# Altium project 4x tmc5160.PrjPcb (part 2 of 2)

## Sheet 4x tmc5160.SchDoc
size 297 x 209 mm
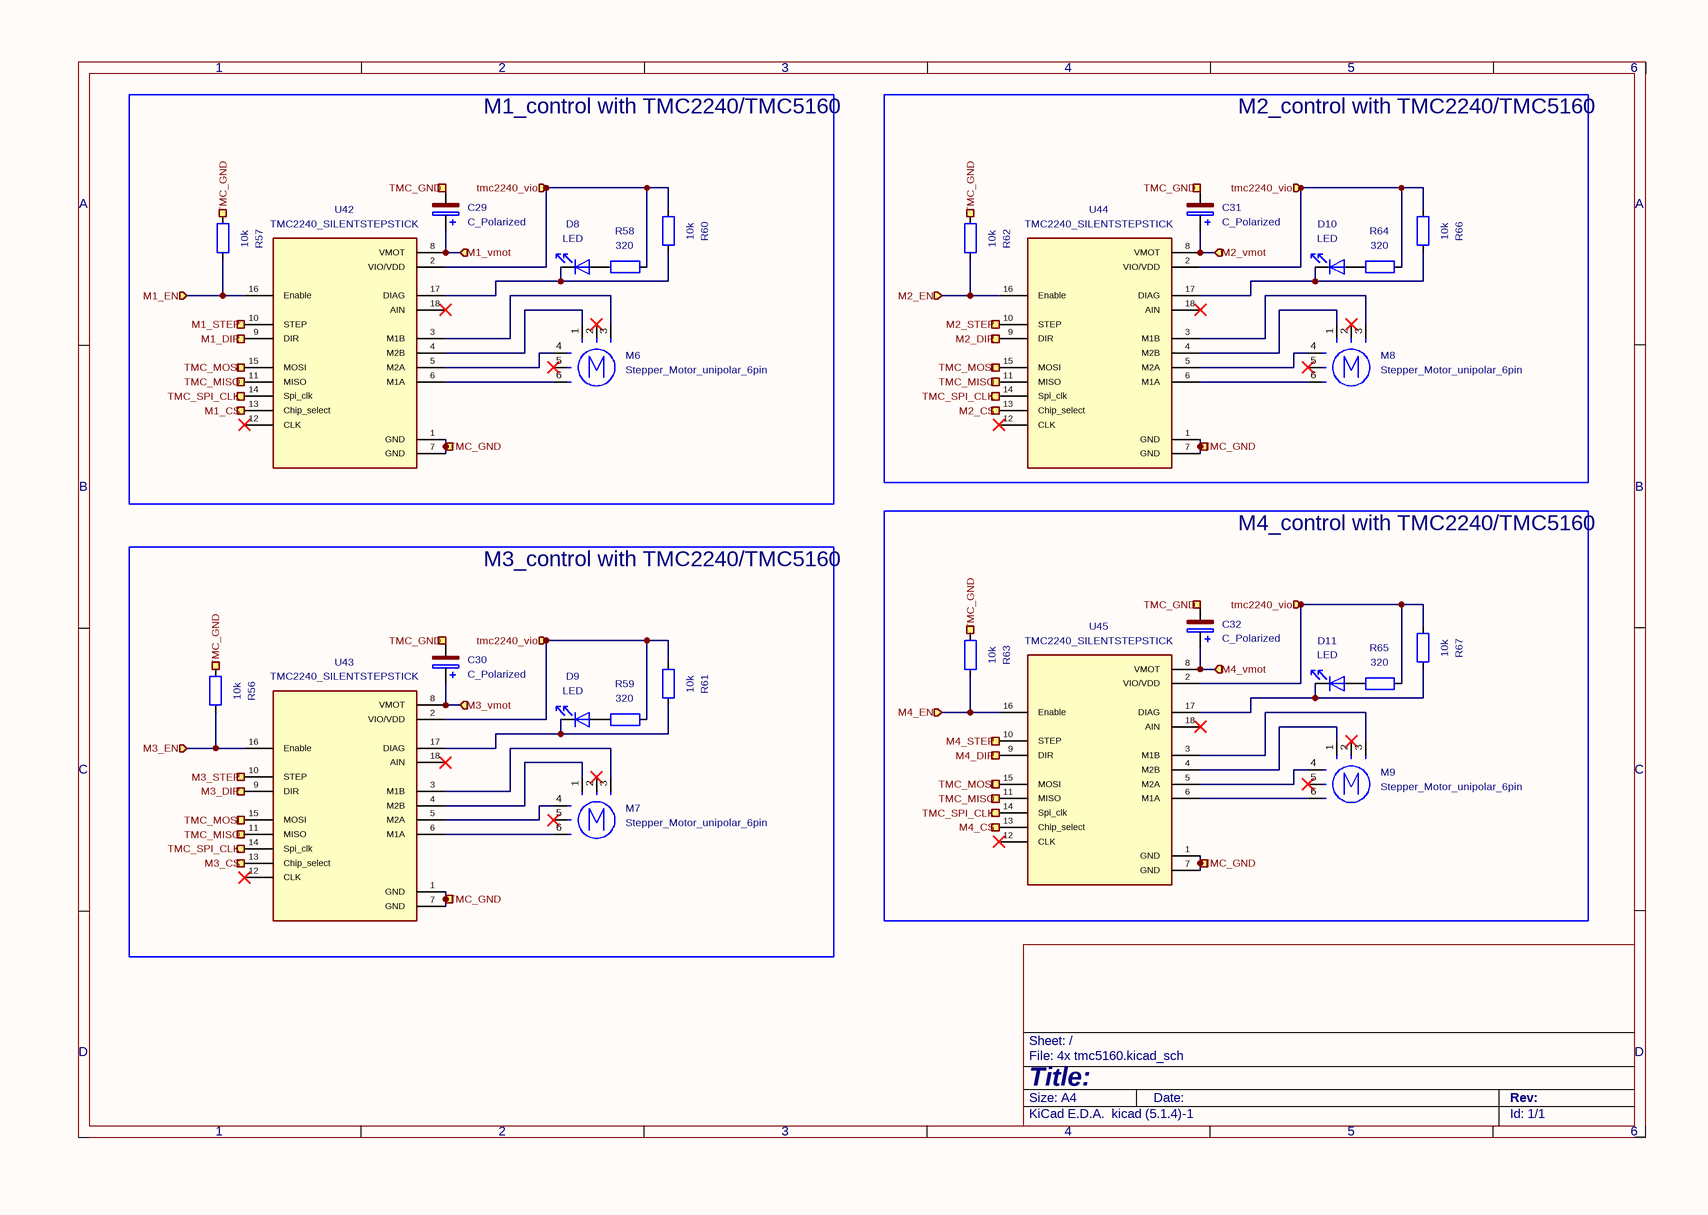
[diagram p7: 4x tmc5160.SchDoc]

### Parts
C29  C_Polarized
C30  C_Polarized
C31  C_Polarized
C32  C_Polarized
D8  LED
D9  LED
D10  LED
D11  LED
M6  Stepper_Motor_unipolar_6pin
M7  Stepper_Motor_unipolar_6pin
M8  Stepper_Motor_unipolar_6pin
M9  Stepper_Motor_unipolar_6pin
R56  10k
R57  10k
R58  320
R59  320
R60  10k
R61  10k
R62  10k
R63  10k
R64  320
R65  320
R66  10k
R67  10k
U42  TMC2240_SILENTSTEPSTICK  [MODULE_TMC2209_SILENTSTEPSTICK]
U43  TMC2240_SILENTSTEPSTICK  [MODULE_TMC2209_SILENTSTEPSTICK]
U44  TMC2240_SILENTSTEPSTICK  [MODULE_TMC2209_SILENTSTEPSTICK]
U45  TMC2240_SILENTSTEPSTICK  [MODULE_TMC2209_SILENTSTEPSTICK]

### Blocks framed on the sheet
M1_control with TMC2240/TMC5160: C29 D8 M6 R57 R58 R60 U42
M2_control with TMC2240/TMC5160: C31 D10 M8 R62 R64 R66 U44
M4_control with TMC2240/TMC5160: C32 D11 M9 R63 R65 R67 U45
M3_control with TMC2240/TMC5160: C30 D9 M7 R56 R59 R61 U43

### Ports
M1_CS (in), M1_DIR (in), M1_EN (in), M1_STEP (in), M1_vmot (in), M2_CS (in), M2_DIR (in), M2_EN (in), M2_STEP (in), M2_vmot (in), M3_CS (in), M3_DIR (in), M3_EN (in), M3_STEP (in), M3_vmot (in), M4_CS (in), M4_DIR (in), M4_EN (in), M4_STEP (in), M4_vmot (in), tmc2240_vio (in), TMC_GND (in), TMC_MISO (in), TMC_MOSI (in), TMC_SPI_CLK (in)

### Nets
M1_CS: U42.13(Chip_select) ; port M1_CS
M1_DIR: U42.9(DIR) ; port M1_DIR
M1_EN: R57.1 U42.16(Enable) ; port M1_EN
M1_STEP: U42.10(STEP) ; port M1_STEP
M1_vmot: C29.1 U42.8(VMOT) ; port M1_vmot
M2_CS: U44.13(Chip_select) ; port M2_CS
M2_DIR: U44.9(DIR) ; port M2_DIR
M2_EN: R62.1 U44.16(Enable) ; port M2_EN
M2_STEP: U44.10(STEP) ; port M2_STEP
M2_vmot: C31.1 U44.8(VMOT) ; port M2_vmot
M3_CS: U43.13(Chip_select) ; port M3_CS
M3_DIR: U43.9(DIR) ; port M3_DIR
M3_EN: R56.1 U43.16(Enable) ; port M3_EN
M3_STEP: U43.10(STEP) ; port M3_STEP
M3_vmot: C30.1 U43.8(VMOT) ; port M3_vmot
M4_CS: U45.13(Chip_select) ; port M4_CS
M4_DIR: U45.9(DIR) ; port M4_DIR
M4_EN: R63.1 U45.16(Enable) ; port M4_EN
M4_STEP: U45.10(STEP) ; port M4_STEP
M4_vmot: C32.1 U45.8(VMOT) ; port M4_vmot
tmc2240_vio: R58.2 R59.2 R60.2 R61.2 R64.2 R65.2 R66.2 R67.2 U42.2(VIO/VDD) U43.2(VIO/VDD) U44.2(VIO/VDD) U45.2(VIO/VDD) ; port tmc2240_vio
TMC_GND: C29.2 C30.2 C31.2 C32.2 R56.2 R57.2 R62.2 R63.2 U42.1(GND) U42.7(GND) U43.1(GND) U43.7(GND) U44.1(GND) U44.7(GND) U45.1(GND) U45.7(GND) ; port TMC_GND
TMC_MISO: U42.11(MISO) U43.11(MISO) U44.11(MISO) U45.11(MISO) ; port TMC_MISO
TMC_MOSI: U42.15(MOSI) U43.15(MOSI) U44.15(MOSI) U45.15(MOSI) ; port TMC_MOSI
TMC_SPI_CLK: U42.14(Spi_clk) U43.14(Spi_clk) U44.14(Spi_clk) U45.14(Spi_clk) ; port TMC_SPI_CLK
NetD8_1: D8.1(K) R60.1 U42.17(DIAG)
NetD8_2: D8.2(A) R58.1
NetD9_1: D9.1(K) R61.1 U43.17(DIAG)
NetD9_2: D9.2(A) R59.1
NetD10_1: D10.1(K) R66.1 U44.17(DIAG)
NetD10_2: D10.2(A) R64.1
NetD11_1: D11.1(K) R67.1 U45.17(DIAG)
NetD11_2: D11.2(A) R65.1
NetM6_1: M6.1 U42.4(M2B)
NetM6_3: M6.3(-) U42.3(M1B)
NetM6_4: M6.4 U42.5(M2A)
NetM6_6: M6.6 U42.6(M1A)
NetM7_1: M7.1 U43.4(M2B)
NetM7_3: M7.3(-) U43.3(M1B)
NetM7_4: M7.4 U43.5(M2A)
NetM7_6: M7.6 U43.6(M1A)
NetM8_1: M8.1 U44.4(M2B)
NetM8_3: M8.3(-) U44.3(M1B)
NetM8_4: M8.4 U44.5(M2A)
NetM8_6: M8.6 U44.6(M1A)
NetM9_1: M9.1 U45.4(M2B)
NetM9_3: M9.3(-) U45.3(M1B)
NetM9_4: M9.4 U45.5(M2A)
NetM9_6: M9.6 U45.6(M1A)

Not connected (* = marked no-connect by the designer): M6 2* 5*; M7 2* 5*; M8 2* 5*; M9 2* 5*; U42 12(CLK)* 18(AIN)*; U43 12(CLK)* 18(AIN)*; U44 12(CLK)* 18(AIN)*; U45 12(CLK)* 18(AIN)*

### Notes on the sheet
- 1
- 2
- 3
- 4
- 5
- 6
- A
- B
- C
- D
- Title:
- File: 4x tmc5160.kicad_sch
- Sheet: /
- KiCad E.D.A.  kicad (5.1.4)-1
- Size: A4
- Date:
- Rev:
- Id: 1/1

### Library data of the parts
R56-R67 = R
  R56 R57 R60-R63 R66 R67: Value: 10k
  R58 R59 R64 R65: Value: 320
U42-U45 = TMC2209_SILENTSTEPSTICK: MF: Trinamic Motion Control GmbH; Description_1: \n                        \n                            TMC2209 Motor Controller/Driver Power Management Evaluation Board\n                        \n; MP: TMC2209 SILENTSTEPSTICK; Package: None; Price: None; Check_prices: https://www.snapeda.com/parts/TMC2209%20SILENTSTEPSTICK/Trinamic/view-part/?ref=eda; STANDARD: Manufacturer Recommendations; PARTREV: 1.20; SnapEDA_Link: https://www.snapeda.com/parts/TMC2209%20SILENTSTEPSTICK/Trinamic/view-part/?ref=snap; MANUFACTURER: Trinamic Motion Control GmbH; Availability: In Stock; SNAPEDA_PN: TMC2209 SILENTSTEPSTICK; Value: TMC2240_SILENTSTEPSTICK; Footprint: fds:MODULE_TMC2209_SILENTSTEPSTICK
C29-C32 = C_Polarized: Value: C_Polarized
D8-D11 = LED: Value: LED
M6-M9 = Stepper_Motor_unipolar_6pin: Value: Stepper_Motor_unipolar_6pin

## Sheet adc.SchDoc
size 297 x 209 mm
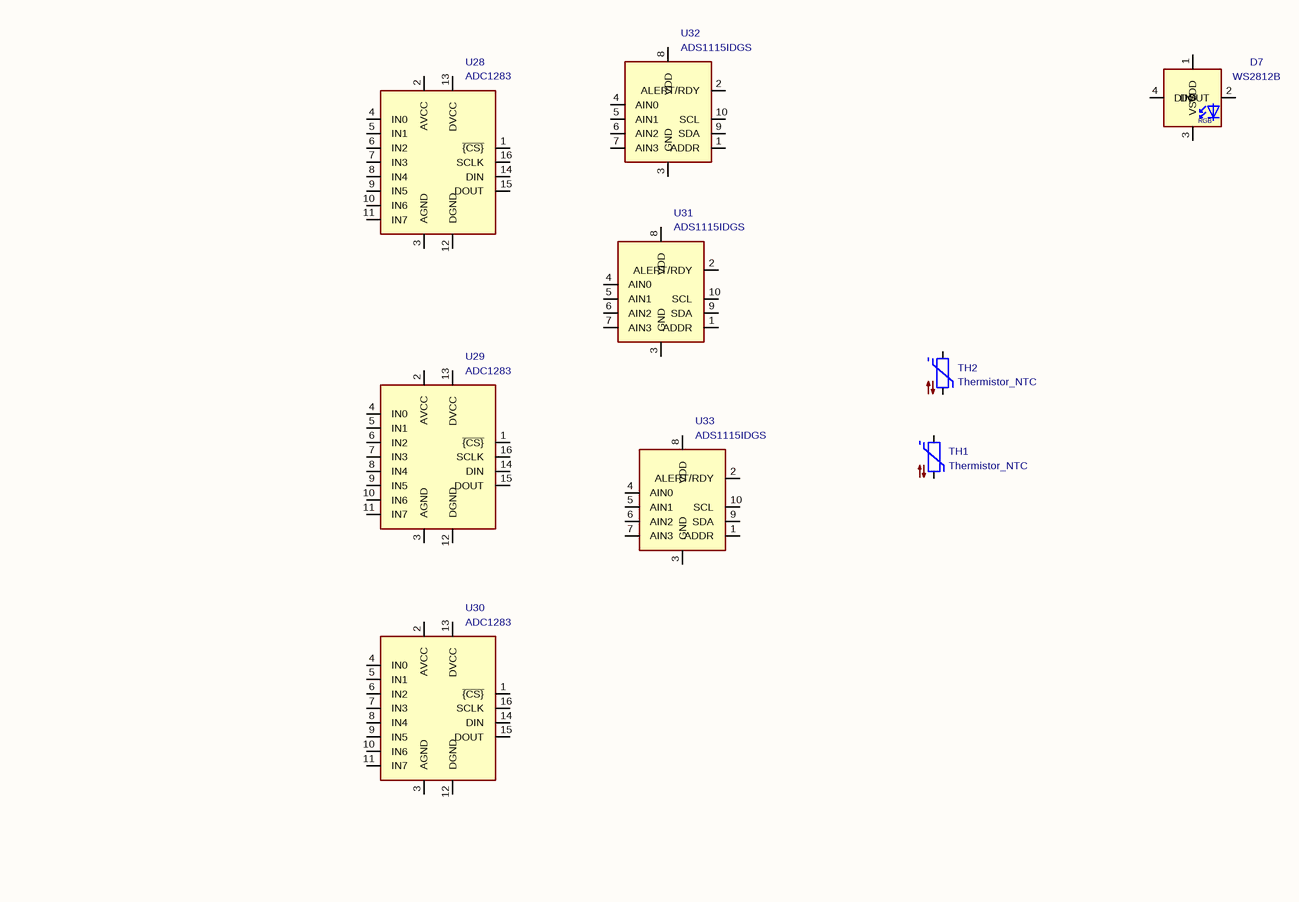
[diagram p8: adc.SchDoc]

### Parts
D7  WS2812B  [LED_WS2812B_PLCC4_5.0x5.0mm_P3.2mm]
TH1  Thermistor_NTC
TH2  Thermistor_NTC
U28  ADC1283  [TSSOP-16_4.4x5mm_P0.65mm]
U29  ADC1283  [TSSOP-16_4.4x5mm_P0.65mm]
U30  ADC1283  [TSSOP-16_4.4x5mm_P0.65mm]
U31  ADS1115IDGS  [TSSOP-10_3x3mm_P0.5mm]
U32  ADS1115IDGS  [TSSOP-10_3x3mm_P0.5mm]
U33  ADS1115IDGS  [TSSOP-10_3x3mm_P0.5mm]

### Nets

Not connected (* = marked no-connect by the designer): D7 1(VDD) 2(DOUT) 3(VSS) 4(DIN); TH1 1 2; TH2 1 2; U28 1(~{{CS}}) 2(AVCC) 3(AGND) 4(IN0) 5(IN1) 6(IN2) 7(IN3) 8(IN4) 9(IN5) 10(IN6) 11(IN7) 12(DGND) 13(DVCC) 14(DIN) 15(DOUT) 16(SCLK); U29 1(~{{CS}}) 2(AVCC) 3(AGND) 4(IN0) 5(IN1) 6(IN2) 7(IN3) 8(IN4) 9(IN5) 10(IN6) 11(IN7) 12(DGND) 13(DVCC) 14(DIN) 15(DOUT) 16(SCLK); U30 1(~{{CS}}) 2(AVCC) 3(AGND) 4(IN0) 5(IN1) 6(IN2) 7(IN3) 8(IN4) 9(IN5) 10(IN6) 11(IN7) 12(DGND) 13(DVCC) 14(DIN) 15(DOUT) 16(SCLK); U31 1(ADDR) 2(ALERT/RDY) 3(GND) 4(AIN0) 5(AIN1) 6(AIN2) 7(AIN3) 8(VDD) 9(SDA) 10(SCL); U32 1(ADDR) 2(ALERT/RDY) 3(GND) 4(AIN0) 5(AIN1) 6(AIN2) 7(AIN3) 8(VDD) 9(SDA) 10(SCL); U33 1(ADDR) 2(ALERT/RDY) 3(GND) 4(AIN0) 5(AIN1) 6(AIN2) 7(AIN3) 8(VDD) 9(SDA) 10(SCL)

### Notes on the sheet
- 1
- 2
- 3
- 4
- 5
- 6
- A
- B
- C
- D
- Title:
- File: adc.kicad_sch
- Sheet: /
- KiCad E.D.A.  kicad (5.1.4)-1
- Size: A4
- Date:
- Rev:
- Id: 1/1
- (in symbol WS2812B) RGB

### Library data of the parts
D7 = WS2812B: Description: RGB LED with integrated controller; Value: WS2812B; Footprint: LED_SMD:LED_WS2812B_PLCC4_5.0x5.0mm_P3.2mm
TH1 TH2 = Thermistor_NTC: Description: Temperature dependent resistor, negative temperature coefficient; Value: Thermistor_NTC
U28-U30 = ADC1283: Description: Low power 8-channel single ended 12-bit SAR ADC, 50 ksps to 200 ksps, SPI, TSSOP-16; Value: ADC1283; Footprint: Package_SO:TSSOP-16_4.4x5mm_P0.65mm
U31-U33 = ADS1115IDGS: Description: Ultra-Small, Low-Power, I2C-Compatible, 860-SPS, 16-Bit ADCs With Internal Reference, Oscillator, and Programmable Comparator, VSSOP-10; Value: ADS1115IDGS; Footprint: Package_SO:TSSOP-10_3x3mm_P0.5mm

## Sheet USB2-HUB.SchDoc
size 1188 x 840 mm
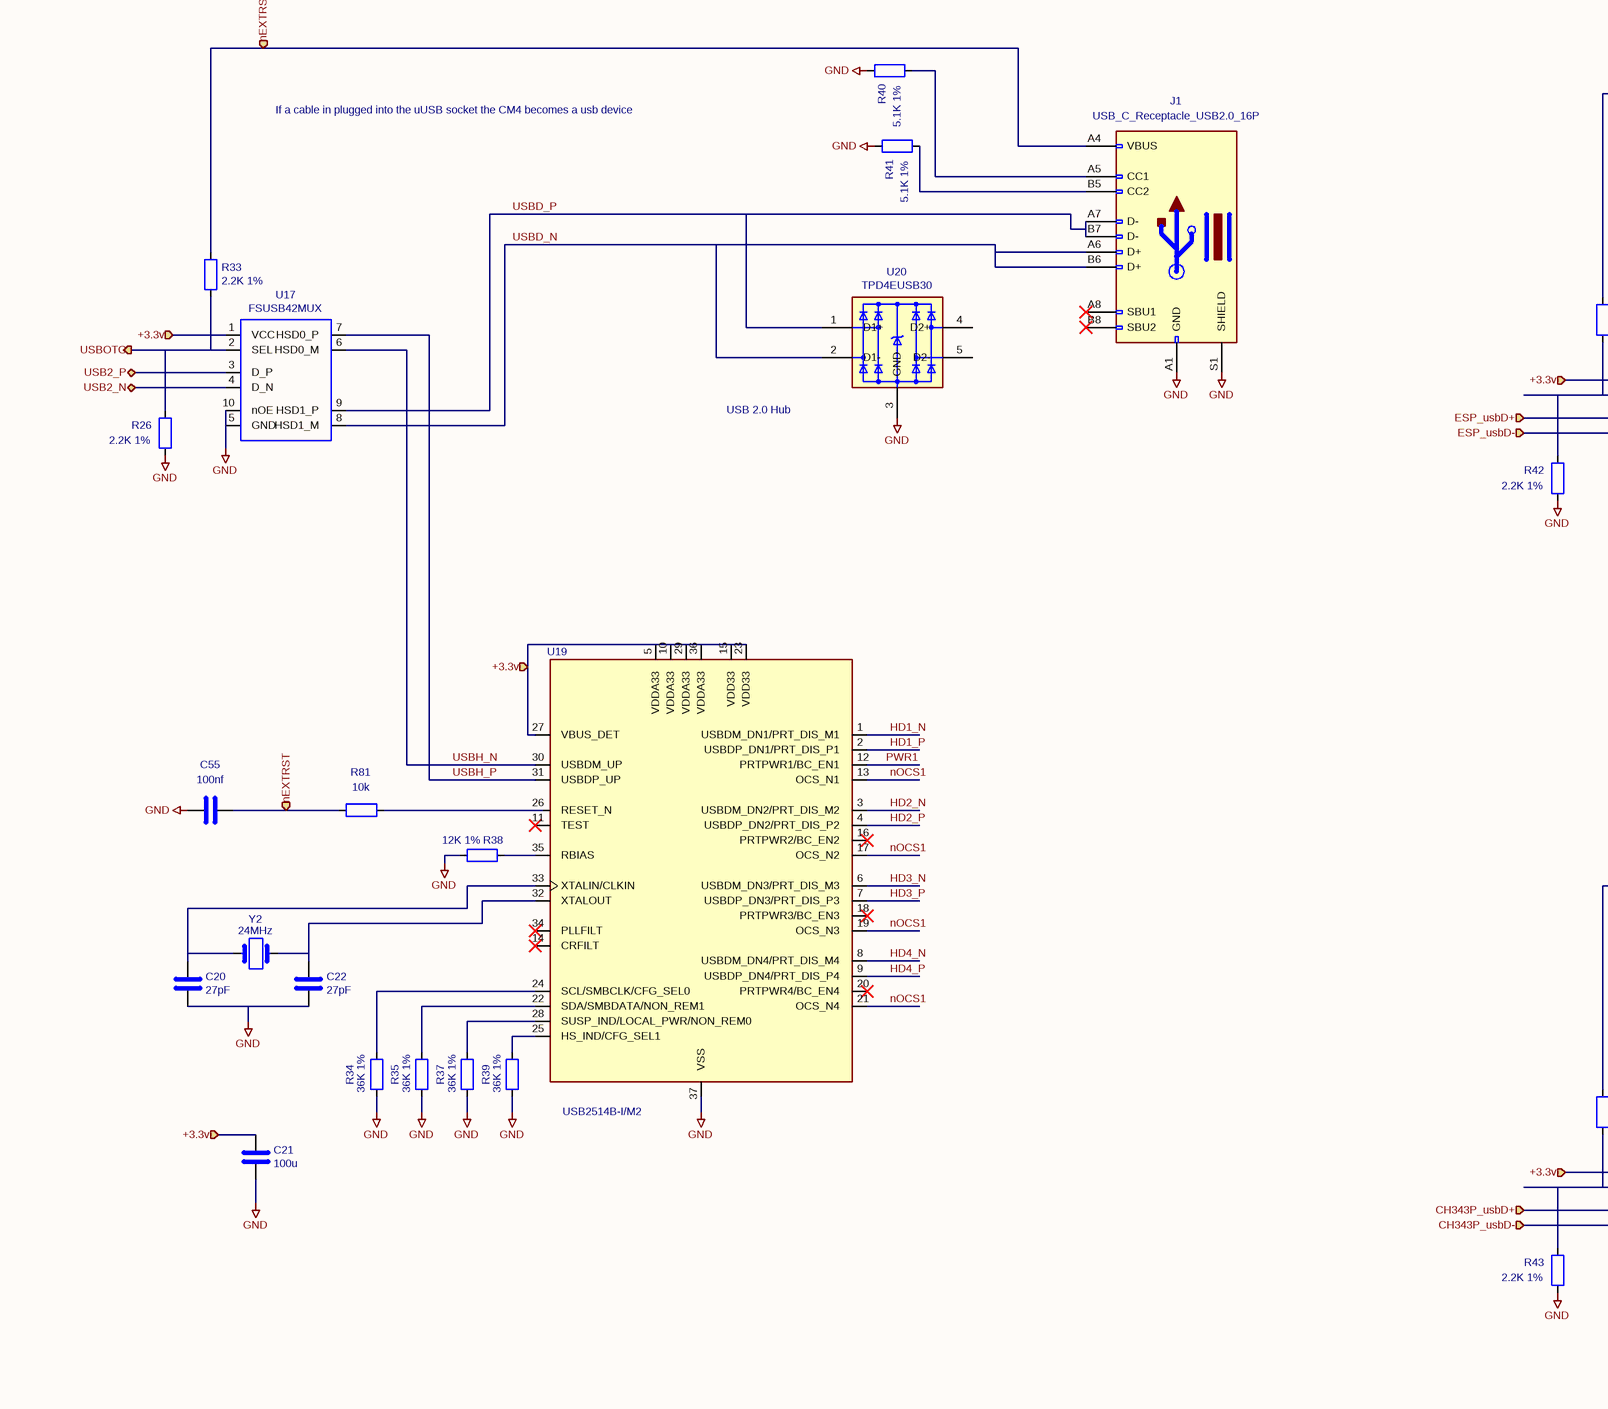
[diagram p9: USB2-HUB.SchDoc, top left]
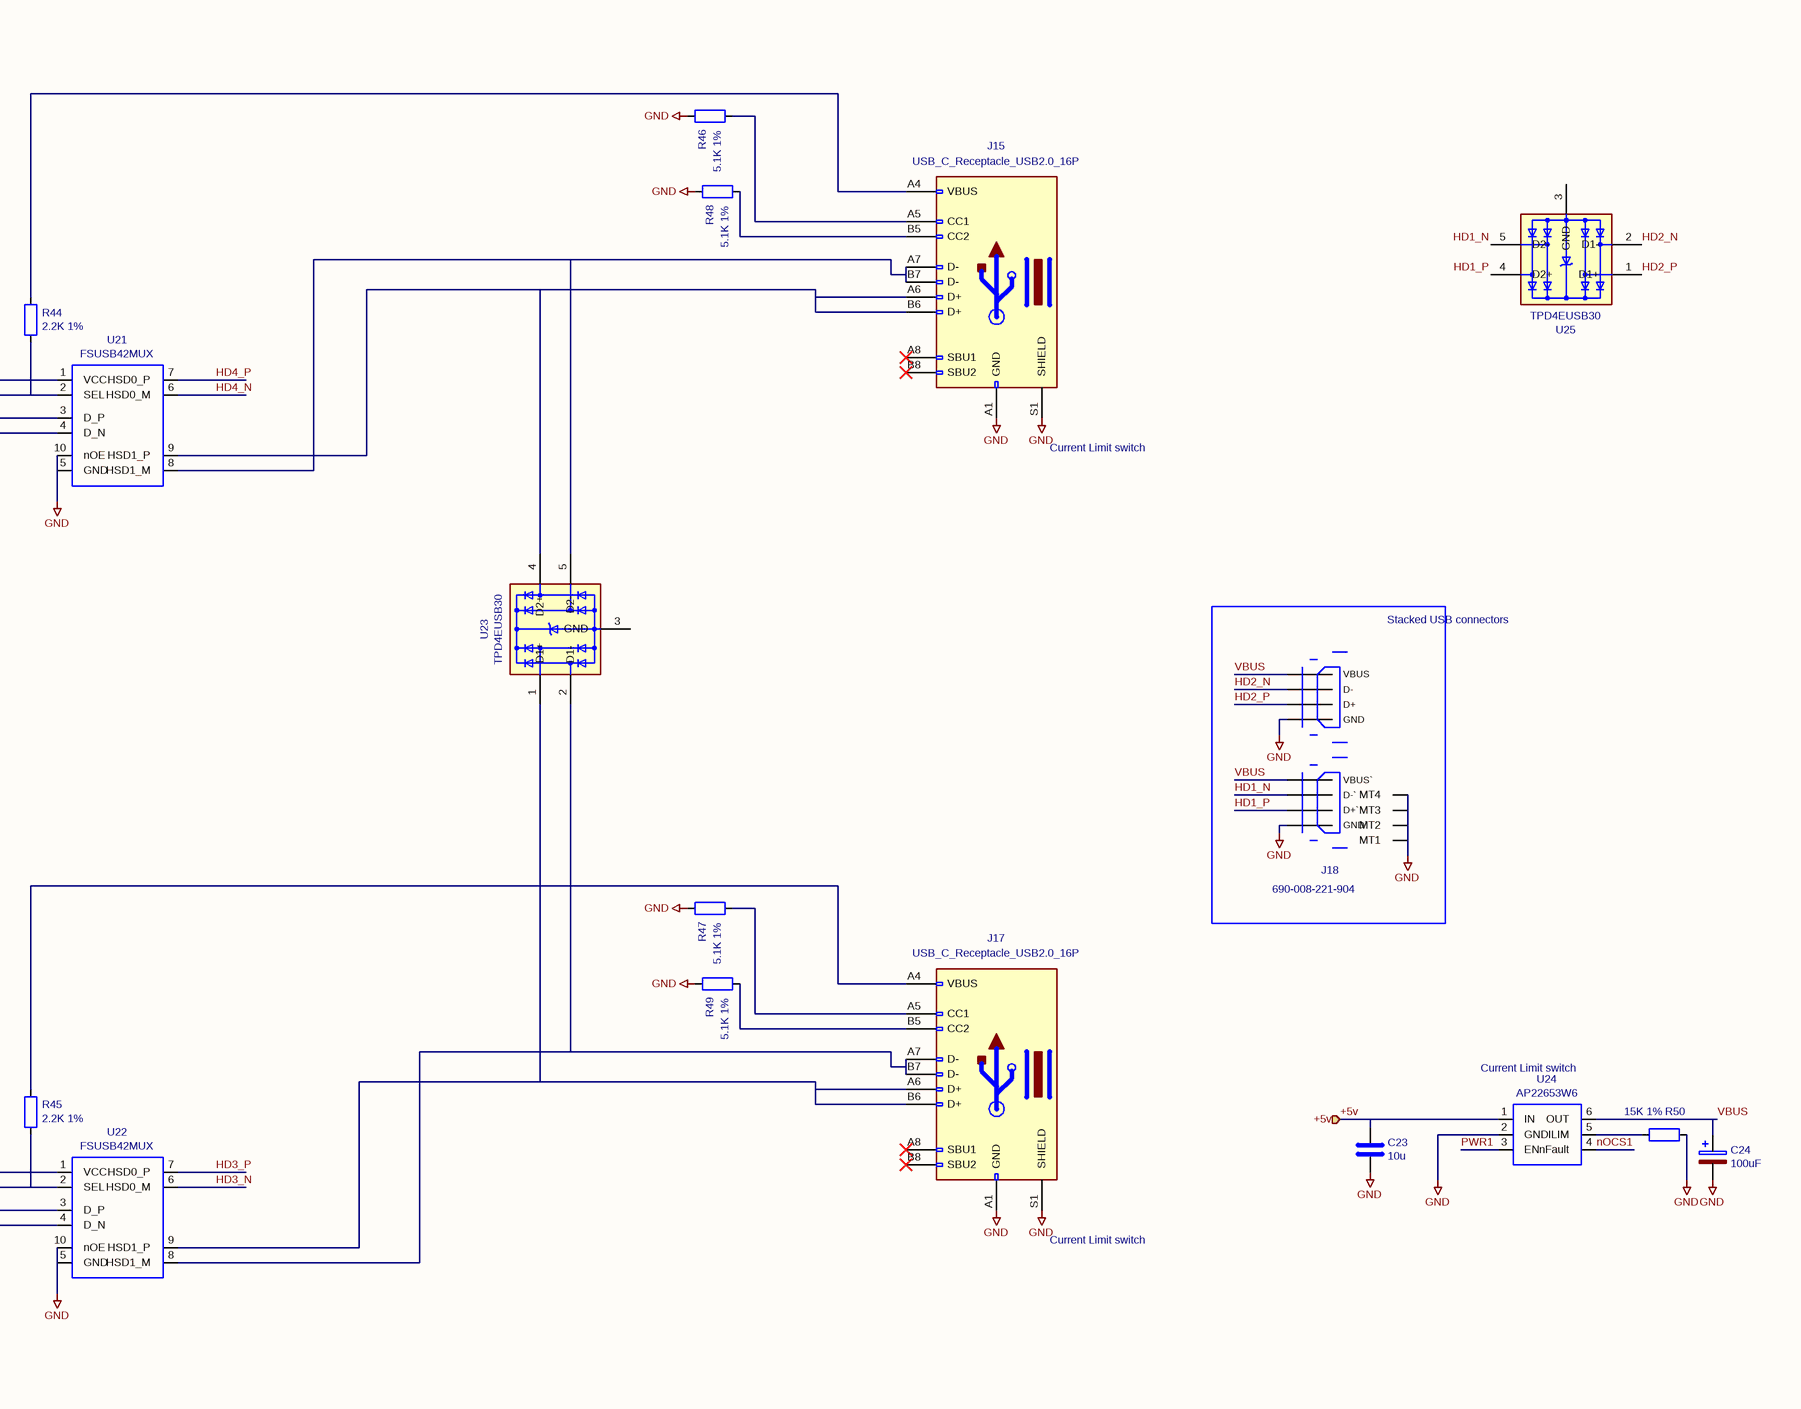
[diagram p10: USB2-HUB.SchDoc, top right]
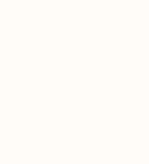
[diagram p11: USB2-HUB.SchDoc, bottom left]

### Parts
C20  27pF  [C_0805_2012Metric]
C21  100u  [C_0805_2012Metric]
C22  27pF  [C_0805_2012Metric]
C23  10u  [C_0805_2012Metric]
C24  100uF  [CP_EIA-7343-31_Kemet-D]
C55  100nf
J1  USB_C_Receptacle_USB2.0_16P  [USB_C_Receptacle_Palconn_UTC16-G]
J15  USB_C_Receptacle_USB2.0_16P  [USB_C_Receptacle_Palconn_UTC16-G]
J17  USB_C_Receptacle_USB2.0_16P  [USB_C_Receptacle_Palconn_UTC16-G]
J18  690-008-221-904  [MOLEX_USB_67298-4090]
R26  2.2K 1%  [R_0805_2012Metric_Pad1.20x1.40mm_HandSolder]
R33  2.2K 1%  [R_0805_2012Metric_Pad1.20x1.40mm_HandSolder]
R34  36K 1%  [R_0805_2012Metric_Pad1.20x1.40mm_HandSolder]
R35  36K 1%  [R_0805_2012Metric_Pad1.20x1.40mm_HandSolder]
R37  36K 1%  [R_0805_2012Metric_Pad1.20x1.40mm_HandSolder]
R38  12K 1%  [R_0805_2012Metric_Pad1.20x1.40mm_HandSolder]
R39  36K 1%  [R_0805_2012Metric_Pad1.20x1.40mm_HandSolder]
R40  5.1K 1%  [R_0805_2012Metric_Pad1.20x1.40mm_HandSolder]
R41  5.1K 1%  [R_0805_2012Metric_Pad1.20x1.40mm_HandSolder]
R42  2.2K 1%  [R_0805_2012Metric_Pad1.20x1.40mm_HandSolder]
R43  2.2K 1%  [R_0805_2012Metric_Pad1.20x1.40mm_HandSolder]
R44  2.2K 1%  [R_0805_2012Metric_Pad1.20x1.40mm_HandSolder]
R45  2.2K 1%  [R_0805_2012Metric_Pad1.20x1.40mm_HandSolder]
R46  5.1K 1%  [R_0805_2012Metric_Pad1.20x1.40mm_HandSolder]
R47  5.1K 1%  [R_0805_2012Metric_Pad1.20x1.40mm_HandSolder]
R48  5.1K 1%  [R_0805_2012Metric_Pad1.20x1.40mm_HandSolder]
R49  5.1K 1%  [R_0805_2012Metric_Pad1.20x1.40mm_HandSolder]
R50  15K 1%  [R_0805_2012Metric_Pad1.20x1.40mm_HandSolder]
R81  10k
U17  FSUSB42MUX  [MSOP-10_3x3mm_P0.5mm]
U19  USB2514B-I/M2  [QFN-36-1EP_6x6mm_P0.5mm_EP3.7x3.7mm]
U20  TPD4EUSB30  [USON-10_2.5x1.0mm_P0.5mm]
U21  FSUSB42MUX  [MSOP-10_3x3mm_P0.5mm]
U22  FSUSB42MUX  [MSOP-10_3x3mm_P0.5mm]
U23  TPD4EUSB30  [USON-10_2.5x1.0mm_P0.5mm]
U24  AP22653W6  [SOT-23-6]
U25  TPD4EUSB30  [USON-10_2.5x1.0mm_P0.5mm]
Y2  24MHz  [Crystal_SMD_HC49-SD]

### Blocks framed on the sheet
Stacked USB connectors: J18

### Ports
+3.3v (in), +5v (in), CH343P_usbD+ (in), CH343P_usbD- (in), ESP_usbD+ (in), ESP_usbD- (in), nEXTRST (in), USB2_N (bidir), USB2_P (bidir), USBOTG (out)

### Nets
GND: C20.2 C21.2 C22.2 C23.2 C24.2 C55.1 J1.A1(GND) J1.S1(SHIELD) J15.A1(GND) J15.S1(SHIELD) J17.A1(GND) J17.S1(SHIELD) J18.4(GND`) J18.8(GND) J18.MT1 J18.MT2 J18.MT3 J18.MT4 R26.2 R34.2 R35.2 R37.2 R38.1 R39.2 R40.1 R41.1 R42.2 R43.2 R46.1 R47.1 R48.1 R49.1 R50.2 U17.5(GND) U17.10(nOE) U19.37(VSS) U20.3(GND) U21.5(GND) U21.10(nOE) U22.5(GND) U22.10(nOE) U24.2(GND)  [project net DPHY1_C_N]
+3.3v: C21.1 U17.1(VCC) U19.5(VDDA33) U19.10(VDDA33) U19.15(VDD33) U19.23(VDD33) U19.27(VBUS_DET) U19.29(VDDA33) U19.36(VDDA33) U21.1(VCC) U22.1(VCC) ; port +3.3v
+5v: C23.1 U24.1(IN) ; port +5v
CH343P_usbD+: U22.3(D_P) ; port CH343P_usbD+
CH343P_usbD-: U22.4(D_N) ; port CH343P_usbD-
ESP_usbD+: U21.3(D_P) ; port ESP_usbD+
ESP_usbD-: U21.4(D_N) ; port ESP_usbD-
HD1_N: J18.2(D-`) U19.1(USBDM_DN1/PRT_DIS_M1) U25.5(D2-)
HD1_P: J18.3(D+`) U19.2(USBDP_DN1/PRT_DIS_P1) U25.4(D2+)
HD2_N: J18.6(D-) U19.3(USBDM_DN2/PRT_DIS_M2) U25.2(D1-)
HD2_P: J18.7(D+) U19.4(USBDP_DN2/PRT_DIS_P2) U25.1(D1+)
HD3_N: U19.6(USBDM_DN3/PRT_DIS_M3) U22.6(HSD0_M)
HD3_P: U19.7(USBDP_DN3/PRT_DIS_P3) U22.7(HSD0_P)
HD4_N: U19.8(USBDM_DN4/PRT_DIS_M4) U21.6(HSD0_M)
HD4_P: U19.9(USBDP_DN4/PRT_DIS_P4) U21.7(HSD0_P)
nEXTRST: C55.2 J1.A4(VBUS) R33.1 R81.1 ; port nEXTRST
nOCS1: U19.13(OCS_N1) U19.17(OCS_N2) U19.19(OCS_N3) U19.21(OCS_N4) U24.4(nFault)
PWR1: U19.12(PRTPWR1/BC_EN1) U24.3(EN)
USB2_N: U17.4(D_N) ; port USB2_N
USB2_P: U17.3(D_P) ; port USB2_P
USBD_N: J1.A6(D+) J1.B6(D+) U17.8(HSD1_M) U20.2(D1-)
USBD_P: J1.A7(D-) J1.B7(D-) U17.9(HSD1_P) U20.1(D1+)
USBH_N: U17.6(HSD0_M) U19.30(USBDM_UP)
USBH_P: U17.7(HSD0_P) U19.31(USBDP_UP)
USBOTG: R26.1 R33.2 U17.2(SEL) ; port USBOTG
VBUS: C24.1 J18.1(VBUS`) J18.5(VBUS) U24.6(OUT)
NetC20_1: C20.1 U19.33(XTALIN/CLKIN) Y2.1
NetC22_1: C22.1 U19.32(XTALOUT) Y2.2
NetJ1_A5: J1.A5(CC1) R40.2
NetJ1_B5: J1.B5(CC2) R41.2
NetJ15_A4: J15.A4(VBUS) R44.1
NetJ15_A5: J15.A5(CC1) R46.2
NetJ15_A6: J15.A6(D+) J15.B6(D+) U21.9(HSD1_P) U23.4(D2+)
NetJ15_A7: J15.A7(D-) J15.B7(D-) U21.8(HSD1_M) U23.5(D2-)
NetJ15_B5: J15.B5(CC2) R48.2
NetJ17_A4: J17.A4(VBUS) R45.1
NetJ17_A5: J17.A5(CC1) R47.2
NetJ17_A6: J17.A6(D+) J17.B6(D+) U22.9(HSD1_P) U23.1(D1+)
NetJ17_A7: J17.A7(D-) J17.B7(D-) U22.8(HSD1_M) U23.2(D1-)
NetJ17_B5: J17.B5(CC2) R49.2
NetR34_1: R34.1 U19.24(SCL/SMBCLK/CFG_SEL0)
NetR35_1: R35.1 U19.22(SDA/SMBDATA/NON_REM1)
NetR37_1: R37.1 U19.28(SUSP_IND/LOCAL_PWR/NON_REM0)
NetR38_2: R38.2 U19.35(RBIAS)
NetR39_1: R39.1 U19.25(HS_IND/CFG_SEL1)
NetR42_1: R42.1 R44.2 U21.2(SEL)
NetR43_1: R43.1 R45.2 U22.2(SEL)
NetR50_1: R50.1 U24.5(ILIM)
NetR81_2: R81.2 U19.26(RESET_N)

Not connected (* = marked no-connect by the designer): J1 A8(SBU1)* A9(VBUS) A12(GND) B1(GND) B4(VBUS) B8(SBU2)* B9(VBUS) B12(GND); J15 A8(SBU1)* A9(VBUS) A12(GND) B1(GND) B4(VBUS) B8(SBU2)* B9(VBUS) B12(GND); J17 A8(SBU1)* A9(VBUS) A12(GND) B1(GND) B4(VBUS) B8(SBU2)* B9(VBUS) B12(GND); U19 11(TEST)* 14(CRFILT)* 16(PRTPWR2/BC_EN2)* 18(PRTPWR3/BC_EN3)* 20(PRTPWR4/BC_EN4)* 34(PLLFILT)*; U20 4(D2+) 5(D2-) 6 7 8(GND) 9 10; U23 3(GND) 6 7 8(GND) 9 10; U25 3(GND) 6 7 8(GND) 9 10

### Notes on the sheet
- If a cable in plugged into the uUSB socket the CM4 becomes a usb device
- USB 2.0 Hub
- (near J15) Current Limit switch
- (near U24) Current Limit switch
- (near J17) Current Limit switch
- 1
- 2
- 3
- 4
- 5
- 6
- 7
- 8
- 9
- 10
- 11
- 12
- 13
- 14
- 15
- 16
- 17
- 18
- 19
- 20
- 21
- 22
- 23
- A
- B
- C
- D
- E
- F
- G
- H
- I
- J
- K
- L
- M
- N
- O
- P
- www.raspberrypi.com <http://www.raspberrypi.com>
- Title: Compute Module 4 IO Board - USB
- File: USB2-HUB.kicad_sch
- Sheet: /
- © 2020-2022 Raspberry Pi Ltd (formerly Raspberry Pi (Trading) Ltd.)
- KiCad E.D.A.  kicad (5.1.4)-1
- Size: A0
- Date:
- Rev: 1
- Id: 1/1

### Library data of the parts
C20 C22 = C: Part Description: 27pF 5% 50V Ceramic Capacitor C0G, NP0 0402 (1005 Metric); Description: Unpolarized capacitor; Field8: UCAP00738; Field5: 490-17672-1-ND; Field6: GJM1555C1H270JB01D; Field7: Murata; Field4: Digikey; Value: 27pF; Footprint: Capacitor_SMD:C_0805_2012Metric
C21 C23 = C: Part Description: 10uF 10% 10V Ceramic Capacitor X7R 0805 (2012 Metric); Description: Unpolarized capacitor; Field5: 490-14381-1-ND; Field4: Digikey; Field6: GRM21BR71A106KA73L; Field7: Murata; Field8: 111893011; Footprint: Capacitor_SMD:C_0805_2012Metric
  C21: Value: 100u
  C23: Value: 10u
C24 = CP: Part Description: Capacitor, SP-Cap, 100u, 6.3V, 15mR ESR; Field4: Mouser; Field5: 667-EEF-CX0J101R; Value: 100uF; Footprint: Capacitor_Tantalum_SMD:CP_EIA-7343-31_Kemet-D
C55 = C: Description: Unpolarized capacitor; Value: 100nf
J1 J15 J17 = USB_C_Receptacle_USB2.0_16P: Description: USB 2.0-only 16P Type-C Receptacle connector; Value: USB_C_Receptacle_USB2.0_16P; Footprint: Connector_USB:USB_C_Receptacle_Palconn_UTC16-G
J18 = USB_67298-4090: Part Description: USB-A (USB TYPE-A), Stacked Receptacle Connector 8 Position Through Hole, Right Angle; Field4: Farnell; Field5: 2751688; Field6: None; Field7: Molex; Field8: None; Value: 690-008-221-904; Footprint: CM4IO:MOLEX_USB_67298-4090
R26 R33 R40-R49 = R: Part Description: Resistor 2.2K M1005 1% 63mW; Description: Resistor; Field4: Farnell; Field5: 9239278; Field7: KOA EUROPE GMBH; Field6: RK73G1ETQTP2201D; Field8: 120889581; Footprint: Resistor_SMD:R_0805_2012Metric_Pad1.20x1.40mm_HandSolder
  R26 R33 R42-R45: Value: 2.2K 1%
  R40 R41 R46-R49: Value: 5.1K 1%
R34 R35 R37 R39 = R: Part Description: Resistor 36K M1005 1% 63mW; Description: Resistor; Field4: Farnell; Field5: 1458788; Field7: Rohm; Field6: MCR01MZPF3602; Value: 36K 1%; Footprint: Resistor_SMD:R_0805_2012Metric_Pad1.20x1.40mm_HandSolder
R38 = R: Part Description: Resistor 12K M1005 1% 63mW; Description: Resistor; Field4: Farnell; Field5: 9239367; Field7: Rohm; Field6: MCR01MZPF1202; Value: 12K 1%; Footprint: Resistor_SMD:R_0805_2012Metric_Pad1.20x1.40mm_HandSolder
R50 = R: Part Description: Resistor 15K M1005 1% 63mW; Description: Resistor; Field4: Farnell; Field5: 9239375; Field6: MCR01MZPF1502; Field7: Rohm; Field8: 120891581; Value: 15K 1%; Footprint: Resistor_SMD:R_0805_2012Metric_Pad1.20x1.40mm_HandSolder
R81 = R: Description: Resistor; Value: 10k
U17 U21 U22 = FSUSB42MX: Part Description: USB Switch IC 1 Channel 10-MSOP; Field4: Farnell; Field5: 2564479; Field7: Onsemi; Field6: FSUSB42MUX; Value: FSUSB42MUX; Footprint: Package_SO:MSOP-10_3x3mm_P0.5mm
U19 = USB2514B_Bi: Part Description: USB Hub Controller USB Interface 36-SQFN (6x6); Description: USB 2.0 Hi-Speed Hub Controller; Field4: Farnell; Field5: 2775060; Field7: Microchip; Field8: UICC00931; Field6: USB2514B-I/M2; Value: USB2514B-I/M2; Footprint: Package_DFN_QFN:QFN-36-1EP_6x6mm_P0.5mm_EP3.7x3.7mm
U20 U23 U25 = TPD4EUSB30: Part Description: Quad TVS diode for high speed signals (USB3, GigE etc.); Field4: Farnell; Field5: 2335455; Field6: CDDFN10-3324P-13; Field7: Bourns; Field8: UDIO00346; Value: TPD4EUSB30; Footprint: Package_SON:USON-10_2.5x1.0mm_P0.5mm
U24 = AP2553W6: Part Description: Power Switch/Driver 1:1 P-Channel 2.1A SOT-23-6; Field4: Digikey; Field5: AP2553W6-7DICT-ND; Field7: Diodes; Field6: AP22653W6; Value: AP22653W6; Footprint: Package_TO_SOT_SMD:SOT-23-6
Y2 = Crystal: Part Description: 24MHz Crystal 18pf 30ppm 30ppm; Description: Two pin crystal; Field4: Farnell; Field5: 2508493; Field7: AEL; Field6: X24M000000S128; Value: 24MHz; Footprint: Crystal:Crystal_SMD_HC49-SD

## Nets that join several sheets
DPHY1_C_N: CM5IO (8 pins), CM5_GPIO (50 pins), CM5_HighSpeed (78 pins), PCIe-M2 (34 pins), PSUs (24 pins), YD-ESP32-S3 (8 pins), USB2-HUB (42 pins)
+3.3v: CM5IO (C54.1 R80.2 U49.3), CM5_GPIO (11 pins), CM5_HighSpeed (J5.22 J16.22 R8.1)
+5v: CM5IO (C9.1 C18.1 J11.A4 R9.1), CM5_GPIO (9 pins), CM5_HighSpeed (C12.1 U12.1), PCIe-M2 (C4.1 C6.1 C10.1 U8.3)
CAM_GPIO0: CM5_GPIO (Module1.97), CM5_HighSpeed (J5.17)
CAM_GPIO1: CM5_GPIO (Module1.100), CM5_HighSpeed (J5.18)
CC1: CM5IO (J11.A5), CM5_GPIO (Module1.94)
CC2: CM5IO (J11.B5), CM5_GPIO (Module1.96)
CH343P_usbD+: YD-ESP32-S3 (U26.7), USB2-HUB (U22.3)
CH343P_usbD-: YD-ESP32-S3 (U26.8), USB2-HUB (U22.4)
ESP_usbD+: YD-ESP32-S3 (U27.14), USB2-HUB (U21.3)
ESP_usbD-: YD-ESP32-S3 (U27.13), USB2-HUB (U21.4)
GPIO_VREF: CM5_GPIO (Module1.78 R4.2 R5.2), CM5_HighSpeed (R6.1 R7.1)
ID_SC: CM5_GPIO (J8.28 Module1.35), CM5_HighSpeed (J6.1)
ID_SD: CM5_GPIO (J8.27 Module1.36), CM5_HighSpeed (J6.3)
PCIE_CLK_N: CM5_HighSpeed (Module1.112), PCIe-M2 (J4.53)
PCIE_CLK_P: CM5_HighSpeed (Module1.110), PCIe-M2 (J4.55)
PCIE_nCLKREQ: CM5_HighSpeed (Module1.102), PCIe-M2 (J4.52)
PCIE_nRST: CM5_HighSpeed (Module1.109), PCIe-M2 (J4.50)
PCIE_nWAKE: CM5_HighSpeed (Module1.104), PCIe-M2 (J4.54)
PCIE_PWR_EN: CM5_HighSpeed (Module1.106), PCIe-M2 (R14.1 U8.7)
PCIE_RX_N: CM5_HighSpeed (Module1.118), PCIe-M2 (J4.43)
PCIE_RX_P: CM5_HighSpeed (Module1.116), PCIe-M2 (J4.41)
PCIE_TX_N: CM5_HighSpeed (Module1.124), PCIe-M2 (J4.49)
PCIE_TX_P: CM5_HighSpeed (Module1.122), PCIe-M2 (J4.47)
SCL0: CM5_GPIO (Module1.80), CM5_HighSpeed (J5.20)
SDA0: CM5_GPIO (Module1.82), CM5_HighSpeed (J5.21)
TMC_GND: YD-ESP32-S3 (FB1.1), 4x tmc5160 (16 pins)
USB2_N: CM5IO (J11.A7 J11.B7), CM5_HighSpeed (Module1.103)
USB2_P: CM5IO (J11.A6 J11.B6), CM5_HighSpeed (Module1.105)
USBOTG: CM5_GPIO (J2.10), CM5_HighSpeed (Module1.101)